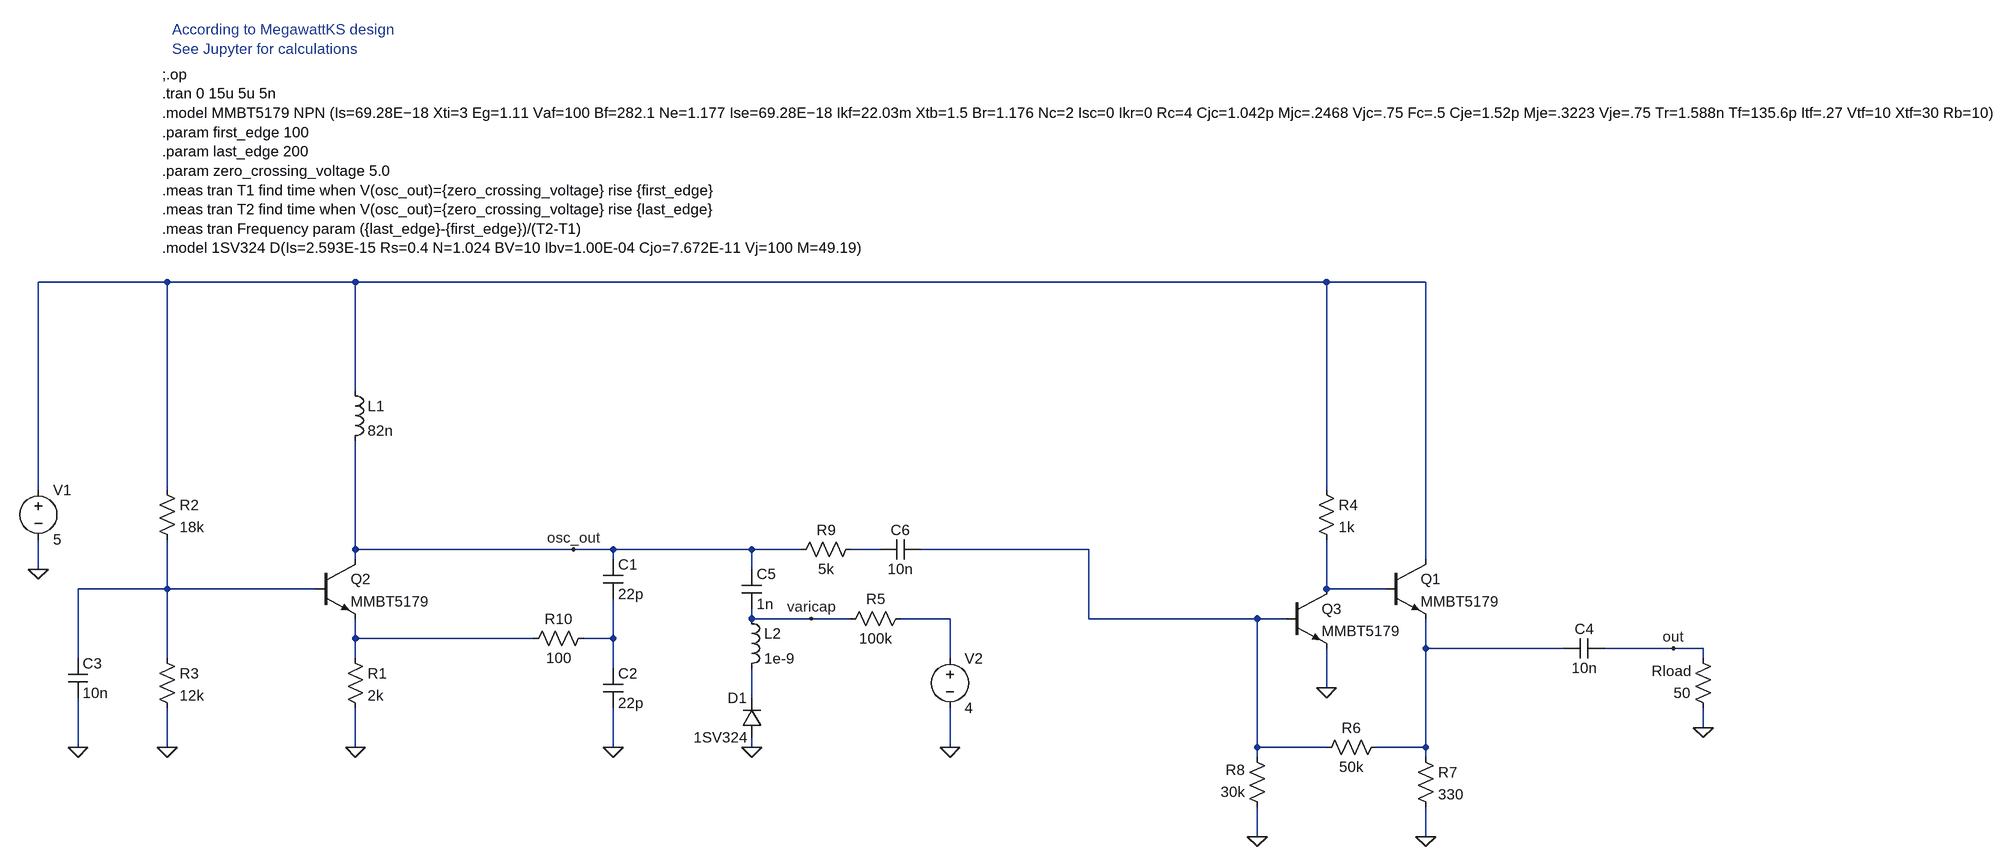
[diagram p0: schematic CB_Colpitts_double_NPN.asc]
CB_Colpitts_double_NPN.asc, the LTspice schematic file:
Version 4
SHEET 1 3300 1348
WIRE 48 -192 -160 -192
WIRE 352 -192 48 -192
WIRE 1920 -192 352 -192
WIRE 2080 -192 1920 -192
WIRE 352 -16 352 -192
WIRE -160 144 -160 -192
WIRE 48 144 48 -192
WIRE 1920 144 1920 -192
WIRE 352 240 352 64
WIRE 704 240 352 240
WIRE 768 240 704 240
WIRE 992 240 768 240
WIRE 1072 240 992 240
WIRE 1200 240 1152 240
WIRE 1536 240 1264 240
WIRE 352 256 352 240
WIRE 768 256 768 240
WIRE 2080 256 2080 -192
WIRE -160 272 -160 224
WIRE 992 272 992 240
WIRE 48 304 48 224
WIRE 48 304 -96 304
WIRE 288 304 48 304
WIRE 1920 304 1920 224
WIRE 2016 304 1920 304
WIRE 992 352 992 336
WIRE 1088 352 992 352
WIRE 1152 352 1088 352
WIRE 1312 352 1232 352
WIRE 1536 352 1536 240
WIRE 1808 352 1536 352
WIRE 1856 352 1808 352
WIRE 352 384 352 352
WIRE 640 384 352 384
WIRE 768 384 768 320
WIRE 768 384 720 384
WIRE 2080 400 2080 352
WIRE 2304 400 2080 400
WIRE 2480 400 2368 400
WIRE 2528 400 2480 400
WIRE -96 416 -96 304
WIRE 48 416 48 304
WIRE 352 416 352 384
WIRE 1312 416 1312 352
WIRE 2528 416 2528 400
WIRE 768 432 768 384
WIRE 1920 464 1920 400
WIRE 992 480 992 432
WIRE 2528 528 2528 496
WIRE -96 560 -96 480
WIRE 48 560 48 496
WIRE 352 560 352 496
WIRE 768 560 768 496
WIRE 992 560 992 544
WIRE 1312 560 1312 496
WIRE 1808 560 1808 352
WIRE 1920 560 1808 560
WIRE 2080 560 2080 400
WIRE 2080 560 2000 560
WIRE 1808 576 1808 560
WIRE 2080 576 2080 560
WIRE 1808 704 1808 656
WIRE 2080 704 2080 656
FLAG -160 272 0
FLAG 48 560 0
FLAG 352 560 0
FLAG 768 560 0
FLAG -96 560 0
FLAG 704 240 osc_out
FLAG 1312 560 0
FLAG 2528 528 0
FLAG 2480 400 out
FLAG 992 560 0
FLAG 1088 352 varicap
FLAG 2080 704 0
FLAG 1808 704 0
FLAG 1920 464 0
DATAFLAG 144 304 ""
DATAFLAG 880 240 ""
DATAFLAG 464 384 ""
DATAFLAG 1360 240 ""
DATAFLAG 1712 352 ""
DATAFLAG 1952 304 ""
DATAFLAG 2144 400 ""
DATAFLAG 1824 560 ""
SYMBOL npn 288 256 R0
SYMATTR InstName Q2
SYMATTR Value MMBT5179
SYMBOL res 336 400 R0
SYMATTR InstName R1
SYMATTR Value 2k
SYMBOL res 32 128 R0
SYMATTR InstName R2
SYMATTR Value 18k
SYMBOL res 32 400 R0
SYMATTR InstName R3
SYMATTR Value 12k
SYMBOL voltage -160 128 R0
SYMATTR InstName V1
SYMATTR Value 5
SYMBOL ind 336 -32 R0
SYMATTR InstName L1
SYMATTR Value 82n
SYMATTR SpiceLine Rser=0.01
SYMBOL cap 752 256 R0
SYMATTR InstName C1
SYMATTR Value 22p
SYMBOL cap 752 432 R0
SYMATTR InstName C2
SYMATTR Value 22p
SYMBOL cap -112 416 R0
SYMATTR InstName C3
SYMATTR Value 10n
SYMBOL res 1248 336 R90
WINDOW 0 0 56 VBottom 2
WINDOW 3 32 56 VTop 2
SYMATTR InstName R5
SYMATTR Value 100k
SYMBOL voltage 1312 400 R0
SYMATTR InstName V2
SYMATTR Value 4
SYMBOL diode 1008 544 R180
WINDOW 0 24 64 Left 2
WINDOW 3 24 0 Left 2
SYMATTR InstName D1
SYMATTR Value 1SV324
SYMBOL ind 976 336 R0
SYMATTR InstName L2
SYMATTR Value 1e-9
SYMBOL cap 1264 224 R90
WINDOW 0 0 32 VBottom 2
WINDOW 3 32 32 VTop 2
SYMATTR InstName C6
SYMATTR Value 10n
SYMBOL res 2544 512 R180
WINDOW 0 36 76 Left 2
WINDOW 3 36 40 Left 2
SYMATTR InstName Rload
SYMATTR Value 50
SYMBOL cap 2368 384 R90
WINDOW 0 0 32 VBottom 2
WINDOW 3 32 32 VTop 2
SYMATTR InstName C4
SYMATTR Value 10n
SYMBOL res 736 368 R90
WINDOW 0 0 56 VBottom 2
WINDOW 3 32 56 VTop 2
SYMATTR InstName R10
SYMATTR Value 100
SYMBOL cap 976 272 R0
SYMATTR InstName C5
SYMATTR Value 1n
SYMBOL npn 2016 256 R0
SYMATTR InstName Q1
SYMATTR Value MMBT5179
SYMBOL res 2064 560 R0
SYMATTR InstName R7
SYMATTR Value 330
SYMBOL res 1904 128 R0
SYMATTR InstName R4
SYMATTR Value 1k
SYMBOL npn 1856 304 R0
SYMATTR InstName Q3
SYMATTR Value MMBT5179
SYMBOL res 2016 544 R90
WINDOW 0 0 56 VBottom 2
WINDOW 3 32 56 VTop 2
SYMATTR InstName R6
SYMATTR Value 50k
SYMBOL res 1824 672 R180
WINDOW 0 36 76 Left 2
WINDOW 3 36 40 Left 2
SYMATTR InstName R8
SYMATTR Value 30k
SYMBOL res 1168 224 R90
WINDOW 0 0 56 VBottom 2
WINDOW 3 32 56 VTop 2
SYMATTR InstName R9
SYMATTR Value 5k
TEXT 40 -528 Left 2 !;.op\n.tran 0 15u 5u 5n\n.model MMBT5179 NPN (Is=69.28E−18 Xti=3 Eg=1.11 Vaf=100 Bf=282.1 Ne=1.177 Ise=69.28E−18 Ikf=22.03m Xtb=1.5 Br=1.176 Nc=2 Isc=0 Ikr=0 Rc=4 Cjc=1.042p Mjc=.2468 Vjc=.75 Fc=.5 Cje=1.52p Mje=.3223 Vje=.75 Tr=1.588n Tf=135.6p Itf=.27 Vtf=10 Xtf=30 Rb=10)\n.param first_edge 100\n.param last_edge 200\n.param zero_crossing_voltage 5.0\n.meas tran T1 find time when V(osc_out)={zero_crossing_voltage} rise {first_edge}\n.meas tran T2 find time when V(osc_out)={zero_crossing_voltage} rise {last_edge}\n.meas tran Frequency param ({last_edge}-{first_edge})/(T2-T1)\n.model 1SV324 D(Is=2.593E-15 Rs=0.4 N=1.024 BV=10 Ibv=1.00E-04 Cjo=7.672E-11 Vj=100 M=49.19)
TEXT 56 -600 Left 2 ;According to MegawattKS design\nSee Jupyter for calculations

The netlist it stands for:
* CB_Colpitts_double_NPN.asc
Q2 osc_out N004 N007 0 MMBT5179
R1 N007 0 2k
R2 N001 N004 18k
R3 N004 0 12k
V1 N001 0 5
L1 N001 osc_out 82n Rser=0.01
C1 osc_out N008 22p
C2 N008 0 22p
C3 N004 0 10n
R5 N006 varicap 100k
V2 N006 0 4
D1 0 N010 1SV324
L2 varicap N010 1e-9
C6 N003 N002 10n
Rload 0 out 50
C4 out N009 10n
R10 N008 N007 100
C5 osc_out varicap 1n
Q1 N001 N005 N009 0 MMBT5179
R7 N009 0 330
R4 N001 N005 1k
Q3 N005 N003 0 0 MMBT5179
R6 N009 N003 50k
R8 0 N003 30k
R9 N002 osc_out 5k
.model D D
.lib standard.dio
.model NPN NPN
.model PNP PNP
.lib standard.bjt
;.op
.tran 0 15u 5u 5n
.model MMBT5179 NPN (Is=69.28E−18 Xti=3 Eg=1.11 Vaf=100 Bf=282.1 Ne=1.177 Ise=69.28E−18 Ikf=22.03m Xtb=1.5 Br=1.176 Nc=2 Isc=0 Ikr=0 Rc=4 Cjc=1.042p Mjc=.2468 Vjc=.75 Fc=.5 Cje=1.52p Mje=.3223 Vje=.75 Tr=1.588n Tf=135.6p Itf=.27 Vtf=10 Xtf=30 Rb=10)
.param first_edge 100
.param last_edge 200
.param zero_crossing_voltage 5.0
.meas tran T1 find time when V(osc_out)={zero_crossing_voltage} rise {first_edge}
.meas tran T2 find time when V(osc_out)={zero_crossing_voltage} rise {last_edge}
.meas tran Frequency param ({last_edge}-{first_edge})/(T2-T1)
.model 1SV324 D(Is=2.593E-15 Rs=0.4 N=1.024 BV=10 Ibv=1.00E-04 Cjo=7.672E-11 Vj=100 M=49.19)
* According to MegawattKS design
* See Jupyter for calculations
.backanno
.end